# Altium project MB1292.PrjPcb (part 2 of 2)

## Sheet Power_management.SchDoc: Power management
size A4; Date: Not used; ApprovedBy: Not used; CheckedBy: Not used; Author: Not used; CompanyName: STMicroelectronics; DrawnBy: Not used; Engineer: Not used; Organization: Not used; Address1: Not used; Address2: Not used; Address3: Not used; Address4: Not used; DocumentNumber: Not used; Revision: Not used; SheetNumber: 7; SheetTotal: 8; CurrentTime: Not used; CurrentDate: Not used; Time: Not used; DocumentFullPathAndName: Not used; DocumentName: Not used; ModifiedDate: Not used; ImagePath: Not used; ProjectName: Not used; Application_BuildNumber: Not used
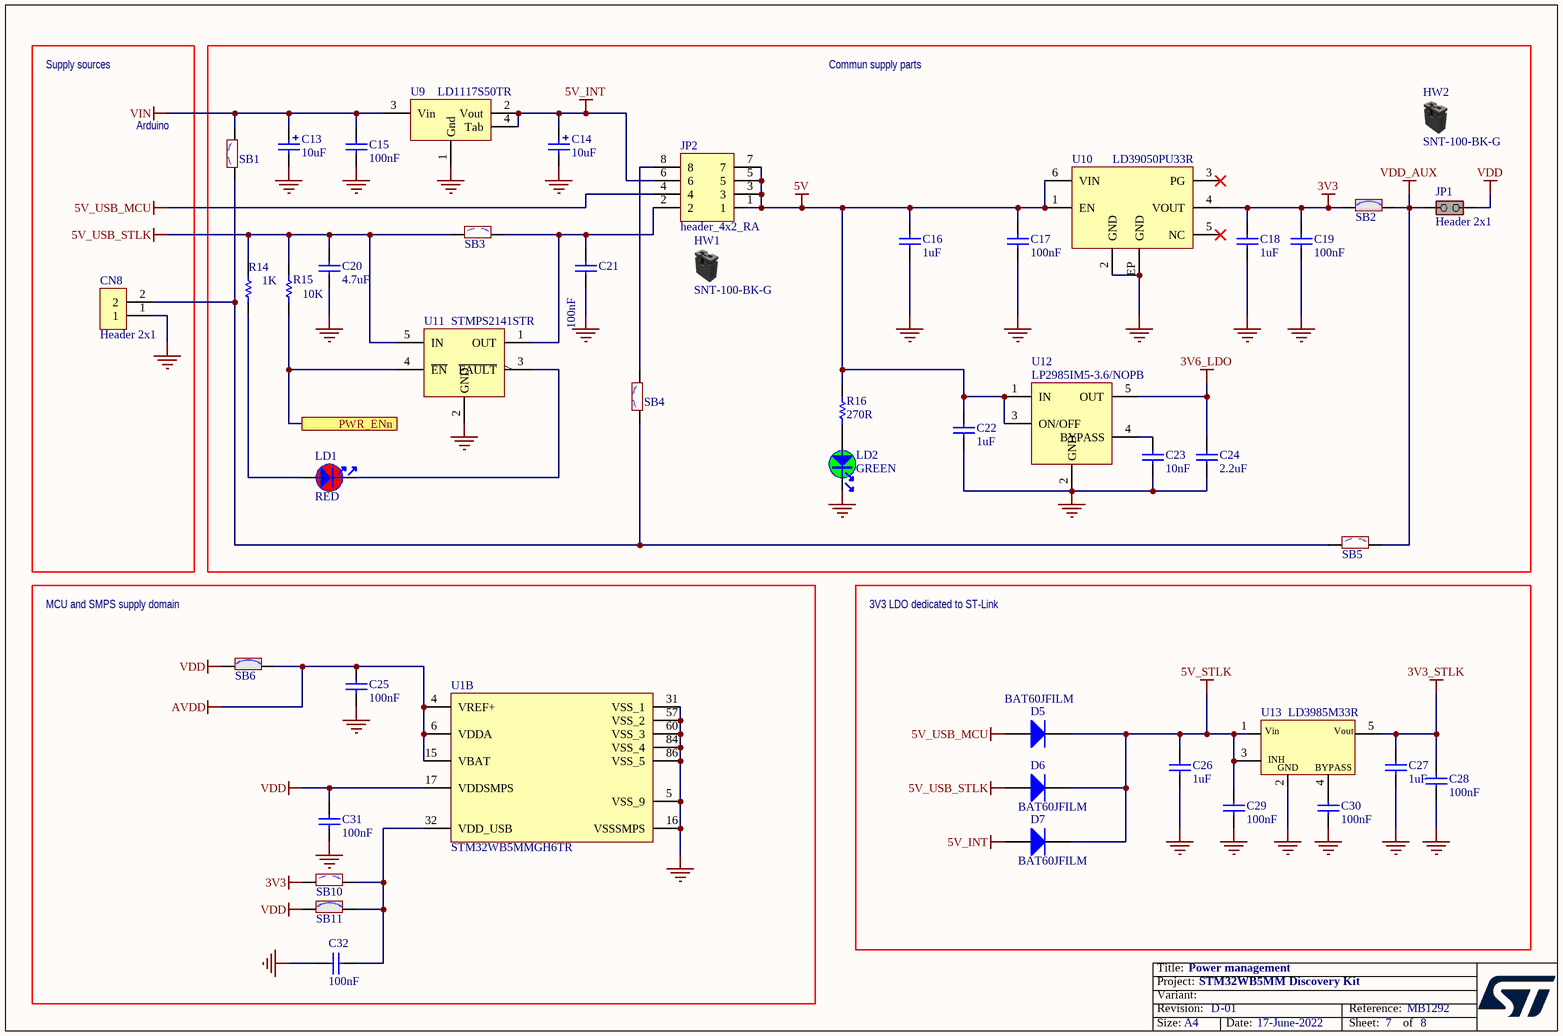
[diagram p4: Power_management.SchDoc]

### Parts
C13  value 10uF  [CPOL_TAJ-B_1210_H210]  (hidden comment: Cap_POL_TANA)
C14  value 10uF  [CPOL_TAJ-B_1210_H210]  (hidden comment: Cap_POL_TANA)
C15  value 100nF  [C0805_H0P85]  (hidden comment: Capacitor)
C16  value 1uF  [C0805_H0P85]  (hidden comment: Capacitor)
C17  value 100nF  [C0201_H0P3]  (hidden comment: Capacitor)
C18  value 1uF  [C0805_H0P85]  (hidden comment: Capacitor)
C19  value 100nF  [C0201_H0P3]  (hidden comment: Capacitor)
C20  value 4.7uF  [C0603_H0P8]  (hidden comment: Capacitor)
C21  value 100nF  [C0805_H0P85]  (hidden comment: Capacitor)
C22  value 1uF  [C0603]  (hidden comment: Capacitor)
C23  value 10nF  [C0603]  (hidden comment: Capacitor)
C24  value 2.2uF  [C0603]  (hidden comment: Capacitor)
C25  value 100nF  [C0201_H0P3]  (hidden comment: Capacitor)
C26  value 1uF  [C0402]  (hidden comment: Capacitor)
C27  value 1uF  [C0402]  (hidden comment: Capacitor)
C28  value 100nF  [C0201_H0P3]  (hidden comment: Capacitor)
C29  value 100nF  [C0201_H0P3]  (hidden comment: Capacitor)
C30  value 100nF  [C0201_H0P3]  (hidden comment: Capacitor)
C31  value 100nF  [C0201_H0P3]  (hidden comment: Capacitor)
C32  value 100nF  [C0201_H0P3]  (hidden comment: Capacitor)
CN8  Header 2x1  [CON_LYCONN_313102S141346]
D5  BAT60JFILM  [DIO_SOD323]
D6  BAT60JFILM  [DIO_SOD323]
D7  BAT60JFILM  [DIO_SOD323]
HW1  value SNT-100-BK-G  (hidden comment: Shunt Black 2.54mm)  (mechanical)
HW2  value SNT-100-BK-G  (hidden comment: Shunt Black 2.54mm)  (mechanical)
JP1  value Header 2x1  [CON_SAMTEC_TSW-102-07-G-S]  (hidden comment: Jumper_Header 2x1 Fitted)
JP2  value header_4x2_RA  [CON_SAMTEC_TSW-104-08-F-D-RA]  (hidden comment: Header 4x2)
LD1  value RED  [LED_0603_VISHAY_VLMS1300-GS08_RED_1A2K_H0P8]  (hidden comment: LED_red)
LD2  value GREEN  [LED_0603_OSRAM_LG-Q396-PS-35_GREEN_1A2K_H0P4]  (hidden comment: LED_green)
R14  value 1K  [R0603]  (hidden comment: Resistor)
R15  value 10K  [R0603]  (hidden comment: Resistor)
R16  value 270R  [R0603]  (hidden comment: Resistor)
SB1  SB_OFF  [SOLDER-BRIDGE_R0603-0R]  (value not drawn)
SB2  SB_ON  [SOLDER-BRIDGE_R0603-0R]  (value not drawn)
SB3  SB_OFF  [SOLDER-BRIDGE_R0603-0R]  (value not drawn)
SB4  SB_OFF  [SOLDER-BRIDGE_R0603-0R]  (value not drawn)
SB5  SB_OFF  [SOLDER-BRIDGE_R0603-0R]  (value not drawn)
SB6  SB_ON  [SOLDER-BRIDGE_R0603-0R]  (value not drawn)
SB10  SB_OFF  [SOLDER-BRIDGE_R0603-0R]  (value not drawn)
SB11  SB_ON  [SOLDER-BRIDGE_R0603-0R]  (value not drawn)
U1  STM32WB5MMGH6TR  [MOD_DORY_STM_86P_7P3X11_H1P342]  (part B of 2)
U9  LD1117S50TR  [REG_SOT223-TAB]
U10  LD39050PU33R  [ICC_DFN6-EPAD_3X3_P095]
U11  STMPS2141STR  [MOS_SOT23-5L]
U12  LP2985IM5-3.6/NOPB  [REG_SOT23-5L]
U13  LD3985M33R  [REG_SOT23-5L]

### Blocks framed on the sheet
Commun supply parts: C13-C24 HW1 HW2 JP1 JP2 LD1 LD2 R14-R16 SB1-SB5 U9-U12
MCU and SMPS supply domain: C25 C31 C32 SB6 SB10 SB11 U1
3V3 LDO dedicated to ST-Link: C26-C30 D5-D7 U13

### Ports
PWR_ENn

### Nets
3V3: C18.2 C19.2 SB2.1 SB10.1 U10.4(VOUT)
3V3_STLK: C27.2 C28.2 U13.5(Vout)
3V6_LDO: C24.2 U12.5(OUT)
5V: C16.2 C17.2 C22.1 JP2.1 JP2.3 JP2.5 JP2.7 R16.2 U10.1(EN) U10.6(VIN) U12.1(IN) U12.3(ON/OFF)
5V_INT: C14.1 D7.1(A) JP2.6 U9.2(Vout) U9.4(Tab)
5V_STLK: C26.2 C29.2 D5.2(K) D6.2(K) D7.2(K) U13.1(Vin) U13.3(CE)
5V_USB_MCU: D5.1(A) JP2.4
5V_USB_STLK: C20.2 D6.1(A) R14.2 R15.2 SB3.1 U11.5(IN)
AVDD: C25.2 SB6.2 U1.4(VREF+) U1.6(VDDA) U1.15(VBAT)
GND: C13.2 C14.2 C15.1 C16.1 C17.1 C18.1 C19.1 C20.1 C21.1 C22.2 C23.1 C24.1 C25.1 C26.1 C27.1 C28.1 C29.1 C30.1 C31.1 C32.2 CN8.1 LD2.2 U1.5(VSS_9) U1.16(VSSSMPS) U1.31(VSS_1) U1.57(VSS_2) U1.60(VSS_3) U1.84(VSS_4) U1.86(VSS_5) U9.1(Gnd) U10.2(GND) U10.EP(GND) U11.2(GND) U12.2(GND) U13.2(GND)
VDD: C31.2 JP1.2(NO) SB6.1 SB11.1 U1.17(VDDSMPS)
VDD_AUX: JP1.1(COMMON) SB2.2 SB5.2
VIN: C13.1 C15.2 SB1.2 U9.3(Vin)
PWR_ENn: R15.1 U11.4(~{EN}) ; port PWR_ENn
NetC21_2: C21.2 JP2.2 SB3.2 U11.1(OUT)
NetC23_2: C23.2 U12.4(BYPASS)
NetC30_2: C30.2 U13.4(BYPASS)
NetC32_1: C32.1 SB10.2 SB11.2 U1.32(VDD_USB)
NetCN8_2: CN8.2 SB1.1 SB4.1 SB5.1
NetJP2_8: JP2.8 SB4.2
NetLD1_1: LD1.1 R14.1
NetLD1_2: LD1.2 U11.3(~{FAULT})
NetLD2_1: LD2.1 R16.1

Not connected (* = marked no-connect by the designer): U10 3(PG)* 5(NC)*

### Notes on the sheet
- Supply sources
- Arduino
- Title:
- Project:
- Size:
- Revision:
- Variant:
- A4
- -
- Date:
- Reference:
- Sheet:
- of
- (in symbol MCD-00086) INH

### Library data of the parts
C13 C14 = MCD-00324: Capacitor, Tantalum, 10uF, 25V,2.5ohms, 10%, pkg Type_B (3528 metric), T=1.9mm; Manufacturer_Part_Number: TAJB106K025RNJ; Manufacturer: AVX; Part_Preference: Recommended; Order_Code_RS: 136-0159; Revision: July-2002: Re-released for DXP Platform.; Internal_Part_Number: MCD-00324; Status: Released; Part_Type: Capacitor; Package: Type_B; ComponentLink1URL: http://tunmcdsvn.tun.st.com/Component_Datasheet_Library/Trunk/Capacitors/AVX_Capacitor_TAJ-series; Order_Code_Digikey: 478-5257-1-ND; Order_Code_Farnell: 2333024
C15 C21 = MCD-01525: Capacitor, MLCC, 100nF, 50V, X7R, 10%, 0805, T=0,85mm; Manufacturer_Part_Number: CC0805KRX7R9BB104; Manufacturer: YAGEO; BMS_Part_Number: 9142249; Part_Preference: Recommended; Order_Code_RS: 669-8842; Internal_Part_Number: MCD-01525; Status: Released; Part_Type: Capacitor; Package: C0805; ComponentLink1URL: http://tunmcdsvn.tun.st.com/Component_Datasheet_Library/Trunk/Capacitors/Yageo_Multilayer_Capacitor_X7R_series_100pF_to_22uF/Yageo_Mutilayer_Capacitor_X7R_100pF_to_22uF.pdf; Order_Code_Digikey: 311-1140-1-ND; Order_Code_Farnell: 3019949
C16 C18 = MCD-01550: Capacitor, MLCC, 1uF, 16V, X5R, +/-10%, 0805, T=0.85mm; Manufacturer_Part_Number: CC0805KRX5R7BB105; Manufacturer: YAGEO; Part_Preference: Recommended; Internal_Part_Number: MCD-01550; Status: Released; Part_Type: Capacitor; Alternate_Manufacturer_Part_Number: N/A; Alternate_Manufacturer: N/A; Package: C0805; ComponentLink1URL: http://tunmcdsvn.tun.st.com/Component_Datasheet_Library/Trunk/Capacitors/Yageo_Multilayer_Capacitor_X7R_series_100pF_to_22uF/YAGEO_MLCC_UPY-GPHC_X7R_6.3V-to-50V_18.pdf; Order_Code_Digikey: 311-3427-1-ND; Order_Code_Farnell: N/A; Order_Code_RS: N/A
C17 C19 C25 C28-C32 = MCD-01535: Capacitor, MLCC,100nF, 10V, X7R, +/-10%, 0201, T=0.3mm; Manufacturer_Part_Number: GRM033R61A104KE15; Manufacturer: MURATA; Part_Preference: Recommended; Order_Code_RS: 790-2742; Internal_Part_Number: MCD-01535; Status: Checked; Part_Type: Capacitor; Package: C0201; ComponentLink1URL: http://tunmcdsvn.tun.st.com/Component_Datasheet_Library/Trunk/Capacitors/Murata_Capacitor_GR_series; Alternate_Manufacturer: N/A; Alternate_Manufacturer_Part_Number: N/A; Order_Code_Digikey: 490-5881-1-ND; Order_Code_Farnell: 2470450
C20 = MCD-01721: Capacitor, MLCC, 4.7uF, 10V, X5R, +/-10%, 0603, T=0.8mm; Manufacturer_Part_Number: CC0603KRX5R6BB475; Manufacturer: YAGEO; Part_Preference: Recommended; Internal_Part_Number: MCD-01721; Status: Released; Part_Type: Capacitor; Package: C0603; ComponentLink1URL: http://tunmcdsvn.tun.st.com/Component_Datasheet_Library/Trunk/Capacitors/Yageo_Multilayer_capacitor_X5R_series_100pF_to_100uF/YAGEO_MLCC_UPY-GPHC_X5R_4V-to-50V_25.pdf; Order_Code_Digikey: 311-1455-1-ND; Order_Code_Farnell: 1458898; Order_Code_RS: N/A
C22 = MCD-00010: Capacitor, MLCC, 1uF, 16V, X5R, +/-10%, 0603, T=0,8mm; Manufacturer_Part_Number: CC0603KRX5R7BB105; Manufacturer: YAGEO; Part_Preference: Recommended; Internal_Part_Number: MCD-00010; Status: Released; Part_Type: Capacitor; Package: C0603; ComponentLink1URL: http://tunmcdsvn.tun.st.com/Component_Datasheet_Library/Trunk/Capacitors/Yageo_Multilayer_capacitor_X5R_series_100pF_to_100uF; Order_Code_Digikey: 311-1444-1-ND; Order_Code_Farnell: 2370680; Order_Code_RS: N/A
C23 = MCD-01007: Capacitor, MLCC, 10nF, 16V, X7R, +/-10%, 0603, T=0.8mm; Manufacturer_Part_Number: CC0603KRX7R7BB103; Manufacturer: YAGEO; Part_Preference: Recommended; Internal_Part_Number: MCD-01007; Status: Released; Part_Type: Capacitor; Package: C0603; ComponentLink1URL: http://tunmcdsvn.tun.st.com/Component_Datasheet_Library/Trunk/Capacitors/Yageo_Multilayer_Capacitor_X7R_series_100pF_to_22uF/; Order_Code_Digikey: 311-3369-1-ND; Order_Code_Farnell: N/A; Order_Code_RS: N/A
C24 = MCD-00012: Capacitor, MLCC, 2.2uF, 10V, X5R, +/- 10%, 0603, T=0,8mm; Manufacturer_Part_Number: CC0603KRX5R6BB225; Manufacturer: YAGEO; Alternate_Manufacturer_Part_Number: C0603C225K8PACTU; Alternate_Manufacturer: KEMET; BMS_Part_Number: 9142010; Part_Preference: Recommended; Internal_Part_Number: MCD-00012; Status: Released; Part_Type: Capacitor; Package: C0603; ComponentLink1URL: http://tunmcdsvn.tun.st.com/Component_Datasheet_Library/Trunk/Capacitors/Yageo_Multilayer_capacitor_X5R_series_100pF_to_100uF; Order_Code_Digikey: 311-1451-1-ND; Order_Code_Farnell: 2370679; Order_Code_RS: N/A
C26 C27 = MCD-01722: Capacitor, MLCC, 1uF, 10V, X5R, +/-10%, 0402, T=0.5mm; Manufacturer_Part_Number: CC0402KRX5R6BB105; Manufacturer: YAGEO; Part_Preference: Recommended; Internal_Part_Number: MCD-01722; Status: Released; Part_Type: Capacitor; Package: C0402; ComponentLink1URL: http://tunmcdsvn.tun.st.com/Component_Datasheet_Library/Trunk/Capacitors/Yageo_Multilayer_capacitor_X5R_series_100pF_to_100uF/Yageo_Multilayer_capacitor_X5R_100pF_to_100uF.pdf; Order_Code_Digikey: 311-1439-1-ND; Order_Code_Farnell: 1458896; Order_Code_RS: N/A
CN8 = MCD-01668: Header 2x1, 2.54mm, VR, TH, height 5.84mm/5.08 mm, height total 13.46 mm; Part_Type: Connector; Manufacturer_Part_Number: 313102S141346; Manufacturer: LYCONN; Part_Preference: Recommended; Internal_Part_Number: MCD-01668; Value: Header 2x1; Status: Released; ComponentLink1URL: http://tunmcdsvn.tun.st.com/Component_Datasheet_Library/Trunk/Connectors/LYCONN_31XXX_2.54mm_L13.46mm/LYCONN_31XXX_2.54mm_L13.46mm.pdf
D5-D7 = MCD-00034: Manufacturer: STMICROELECTRONICS; Part_Type: Diode; BMS_Part_Number: 9151097; Part_Preference: Recommended; Manufacturer_HQ_COO: EU; Internal_Part_Number: MCD-00034; Value: BAT60JFILM; Manufacturer_Part_Number: BAT60JFILM; Status: Released; ComponentLink1URL: http://tunmcdsvn.tun.st.com/Component_Datasheet_Library/Trunk/Diodes/STM_Diode_BAT60JFILM-SOD323
HW1 HW2 = MCD-00043: SHUNT 2.54mm BLACK; Part_Type: Misc; Manufacturer: SAMTEC; Alternate_Manufacturer_Part_Number: 316102S111A; Alternate_Manufacturer: JIUBABA; Part_Preference: Recommended; Internal_Part_Number: MCD-00043; Status: Released; Manufacturer_Part_Number: SNT-100-BK-G; ComponentLink1URL: http://tunmcdsvn.tun.st.com/Component_Datasheet_Library/Trunk/Connectors/Samtec_Shunt_Jumper_SNT100
JP1 = MCD-01904: Header, 2x1, 2,54mm, VR, TH, Height 5.84mm/2.54mm - Shunt Fitted by default; Part_Type: Connector; Manufacturer_Part_Number: TSW-102-07-G-S; Manufacturer: SAMTEC; Part_Preference: Recommended; Order_Code_RS: 155-7981; Internal_Part_Number: MCD-01904; Status: Checked; ComponentLink1URL: http://tunmcdsvn.tun.st.com/Component_Datasheet_Library/Trunk/Connectors/Samtec_TSW-HTSW-series; Alternate_Manufacturer: N/A; Alternate_Manufacturer_Part_Number: N/A; Order_Code_Digikey: SAM1029-02-ND; Order_Code_Farnell: 2505044
JP2 = MCD-02037: Header, 4x2, 2,29mm, RA, TH, height 5,84mm; Part_Type: Connector; Manufacturer_Part_Number: TSW-104-08-F-D-RA; Manufacturer: SAMTEC; Part_Preference: Recommended; Internal_Part_Number: MCD-02037; Status: Released; ComponentLink1URL: http://tunmcdsvn.tun.st.com/Component_Datasheet_Library/Trunk/Connectors/Samtec_TSW-HTSW-series/; Order_Code_Digikey: SAM13034-ND; Order_Code_Farnell: 2032652; Order_Code_RS: N/A; Alternate_Manufacturer_Part_Number: N/A; Alternate_Manufacturer: N/A
LD1 = MCD-00587: LED Red, 0603 SMD, 2V Forward Voltage; Part_Type: Display; Part_Preference: Recommended; Manufacturer: VISHAY; Manufacturer_Part_Number: VLMS1300-GS08; Full_Alternate_Internal_Part_Number: MCD-02401; Component_Country_Of_Origin: China; ShowFields: YES; ID: 3154; Internal_Part_Number: MCD-00587; Status: Released; Package: LED 0603; ComponentLink1URL: http://tunmcdsvn.tun.st.com/Component_Documentation_Library/Trunk/Display/VISHAY_VLMx1300-GS08_Series; Order_Code_Digikey: VLMS1300-GS08CT-ND; Order_Code_Farnell: 2078728; Order_Code_RS: N/A
LD2 = MCD-00588: LED Green, 0603 SMD, Forward Voltage Typ=2V, Max=2.5V; Part_Type: Display; Manufacturer_Part_Number: LG Q396-PS-35; Manufacturer: OSRAM OPTO SEMICONDUCTORS; Alternate_Manufacturer_Part_Number: VLMTG1300-GS08; Alternate_Manufacturer: VISHAY SEMICONDUCTOR OPTO DIVISION; Part_Preference: Recommended; Internal_Part_Number: MCD-00588; Status: Released; Package: LED 0603; ComponentLink1URL: http://tunmcdsvn.tun.st.com/Component_Datasheet_Library/Trunk/Display/OSRAM_LED_GREEN_LG Q396-PS-35; Order_Code_Digikey: LG Q396-PS-35-ND
R14 = MCD-00070: Resistor,1K,0603,1%,1/10W; Manufacturer_Part_Number: RC0603FR-071KL; Manufacturer: YAGEO; Part_Preference: Recommended; Internal_Part_Number: MCD-00070; Status: Released; Part_Type: Resistor; Package: R0603; ComponentLink1URL: http://tunmcdsvn.tun.st.com/Component_Datasheet_Library/Trunk/Resistors/Yageo_Resistor_RC0603-series; Order_Code_Digikey: 311-1.00KHRCT-ND; Order_Code_Farnell: 9238484RL; Order_Code_RS: N/A
R15 = MCD-00220: Resistor,10K,0603,1%,1/10W; Manufacturer_Part_Number: RC0603FR-0710KL; Manufacturer: YAGEO; Part_Preference: Recommended; Internal_Part_Number: MCD-00220; Status: Released; Part_Type: Resistor; Package: R0603; ComponentLink1URL: http://tunmcdsvn.tun.st.com/Component_Datasheet_Library/Trunk/Resistors/Yageo_Resistor_RC0603-series; Order_Code_Digikey: 311-10.0KHRCT-ND; Order_Code_Farnell: 9238603; Order_Code_RS: N/A
R16 = MCD-00442: Resistor,270R,0603,1%,1/10W; Manufacturer_Part_Number: RC0603FR-07270RL; Manufacturer: YAGEO; Part_Preference: Recommended; Internal_Part_Number: MCD-00442; Status: Released; Part_Type: Resistor; Package: R0603; ComponentLink1URL: http://tunmcdsvn.tun.st.com/Component_Datasheet_Library/Trunk/Resistors/Yageo_Resistor_RC0603-series; Order_Code_Digikey: 311-270HRCT-ND; Order_Code_Farnell: 9238417; Order_Code_RS: N/A
SB1 SB3-SB5 SB10 = MCD-00072: Solder Bridge OFF; Part_Type: Misc; Manufacturer_Part_Number: RC0603JR-070RL; Manufacturer: YAGEO; Part_Preference: Recommended; Internal_Part_Number: MCD-00072; Status: Released; Package: SB0603; ComponentLink1URL: http://tunmcdsvn.tun.st.com/Component_Datasheet_Library/Trunk/Resistors/Yageo_Resistor_RC0603-series
SB2 SB6 SB11 = MCD-00071: Solder Bridge ON; Part_Type: Misc; Manufacturer_Part_Number: RC0603JR-070RL; Manufacturer: YAGEO; Part_Preference: Recommended; Internal_Part_Number: MCD-00071; Status: Released; Package: SB0603; ComponentLink1URL: http://tunmcdsvn.tun.st.com/Component_Datasheet_Library/Trunk/Resistors/Yageo_Resistor_RC0603-series
U1 = MCD-01965: STM32 BLE module based on STM32WB55; Part_Type: Misc; Manufacturer: STMICROELECTRONICS; Part_Preference: Recommended; Manufacturer_HQ_COO: EU; Component_Country_Of_Origin: Taiwan; Value: STM32WB5MMGH6TR; Order_Code_Digikey: N/A; Order_Code_Farnell: N/A; Order_Code_RS: N/A; Status: Checked; ComponentLink1URL: http://tunmcdsvn.tun.st.com/Component_Datasheet_Library/Trunk/Misc/STM_STM32WBxxx_dory_module; Internal_Part_Number: MCD-01965; Manufacturer_Part_Number: STM32WB5MMGH6TR; Alternate_Manufacturer_Part_Number: N/A; Alternate_Manufacturer: N/A
U9 = MCD-00088: IC REG LDO 5V 0.8A SOT223; Manufacturer: STMICROELECTRONICS; BMS_Part_Number: 9176133; Part_Preference: Recommended; Manufacturer_HQ_COO: EU; Internal_Part_Number: MCD-00088; Value: LD1117S50TR; Status: Released; Part_Type: IC; Manufacturer_Part_Number: LD1117S50TR; Package: SOT-223; ComponentLink1URL: http://tunmcdsvn.tun.st.com/Component_Datasheet_Library/Trunk/IC/STM_LDO_LD1117
U10 = MCD-00215: Low quiescent current and low noise voltage regulators; Part_Type: IC; Manufacturer: STMICROELECTRONICS; BMS_Part_Number: 9176126; Part_Preference: Recommended; Manufacturer_HQ_COO: EU; Internal_Part_Number: MCD-00215; Value: LD39050PU33R; Status: Released; Manufacturer_Part_Number: LD39050PU33R; Package: DFN6 3x3mm; ComponentLink1URL: http://tunmcdsvn.tun.st.com/Component_Datasheet_Library/Trunk/IC/STM_LDO_LD39050PU
U11 = MCD-00083: Enhanced single channel power switches with active low enable pin; Part_Type: IC; Manufacturer: STMICROELECTRONICS; Alternate_Manufacturer_Part_Number: TPS2041C; Alternate_Manufacturer: TEXAS INSTRUMENTS; BMS_Part_Number: 9159003; Part_Preference: Recommended; Manufacturer_HQ_COO: EU; Internal_Part_Number: MCD-00083; Value: STMPS2141STR; Status: Released; Manufacturer_Part_Number: STMPS2141STR; ComponentLink1URL: http://tunmcdsvn.tun.st.com/Component_Datasheet_Library/Trunk/IC/STM_PWR-Switch_STMPS2141STR
U12 = MCD-01030: LDO VOLTAGE REGULATOR, 3.6V, 150mA, 5-SOT-23, FULL REEL; Part_Type: IC; Manufacturer: TEXAS INSTRUMENTS; Part_Preference: Recommended; Order_Code_RS: 651-9948; Internal_Part_Number: MCD-01030; Value: LP2985IM5-3.6/NOPB; Status: Checked; Manufacturer_Part_Number: LP2985IM5-3.6/NOPB; Package: REG_SOT23-5L; ComponentLink1URL: http://tunmcdsvn.tun.st.com/Component_Datasheet_Library/Trunk/IC/TI_LDO_LP2985IM5-3.6; Alternate_Manufacturer: N/A; Alternate_Manufacturer_Part_Number: N/A; Order_Code_Digikey: LP2985IM5-3.6/NOPBCT-ND; Order_Code_Farnell: 3007634
U13 = MCD-00086: Ultra low drop-low noise BiCMOS voltage, regulators low ESR capacitors compatible; Part_Type: IC; Manufacturer: STMICROELECTRONICS; BMS_Part_Number: 9176161; Part_Preference: Recommended; Manufacturer_HQ_COO: EU; Internal_Part_Number: MCD-00086; Value: LD3985M33R; Status: Released; Manufacturer_Part_Number: LD3985M33R; ComponentLink1URL: http://tunmcdsvn.tun.st.com/Component_Datasheet_Library/Trunk/IC/STM_LDO_LD3985

## Sheet ST-LINK_V2-1.SchDoc: ST-LINK V2-1
size A4; Date: Not used; ApprovedBy: Not used; CheckedBy: Not used; Author: Not used; CompanyName: STMicroelectronics; DrawnBy: Not used; Engineer: Not used; Organization: Not used; Address1: Not used; Address2: Not used; Address3: Not used; Address4: Not used; DocumentNumber: Not used; Revision: Not used; SheetNumber: 8; SheetTotal: 8; CurrentTime: Not used; CurrentDate: Not used; Time: Not used; DocumentFullPathAndName: Not used; DocumentName: Not used; ModifiedDate: Not used; ImagePath: Not used; ProjectName: Not used; Application_BuildNumber: Not used
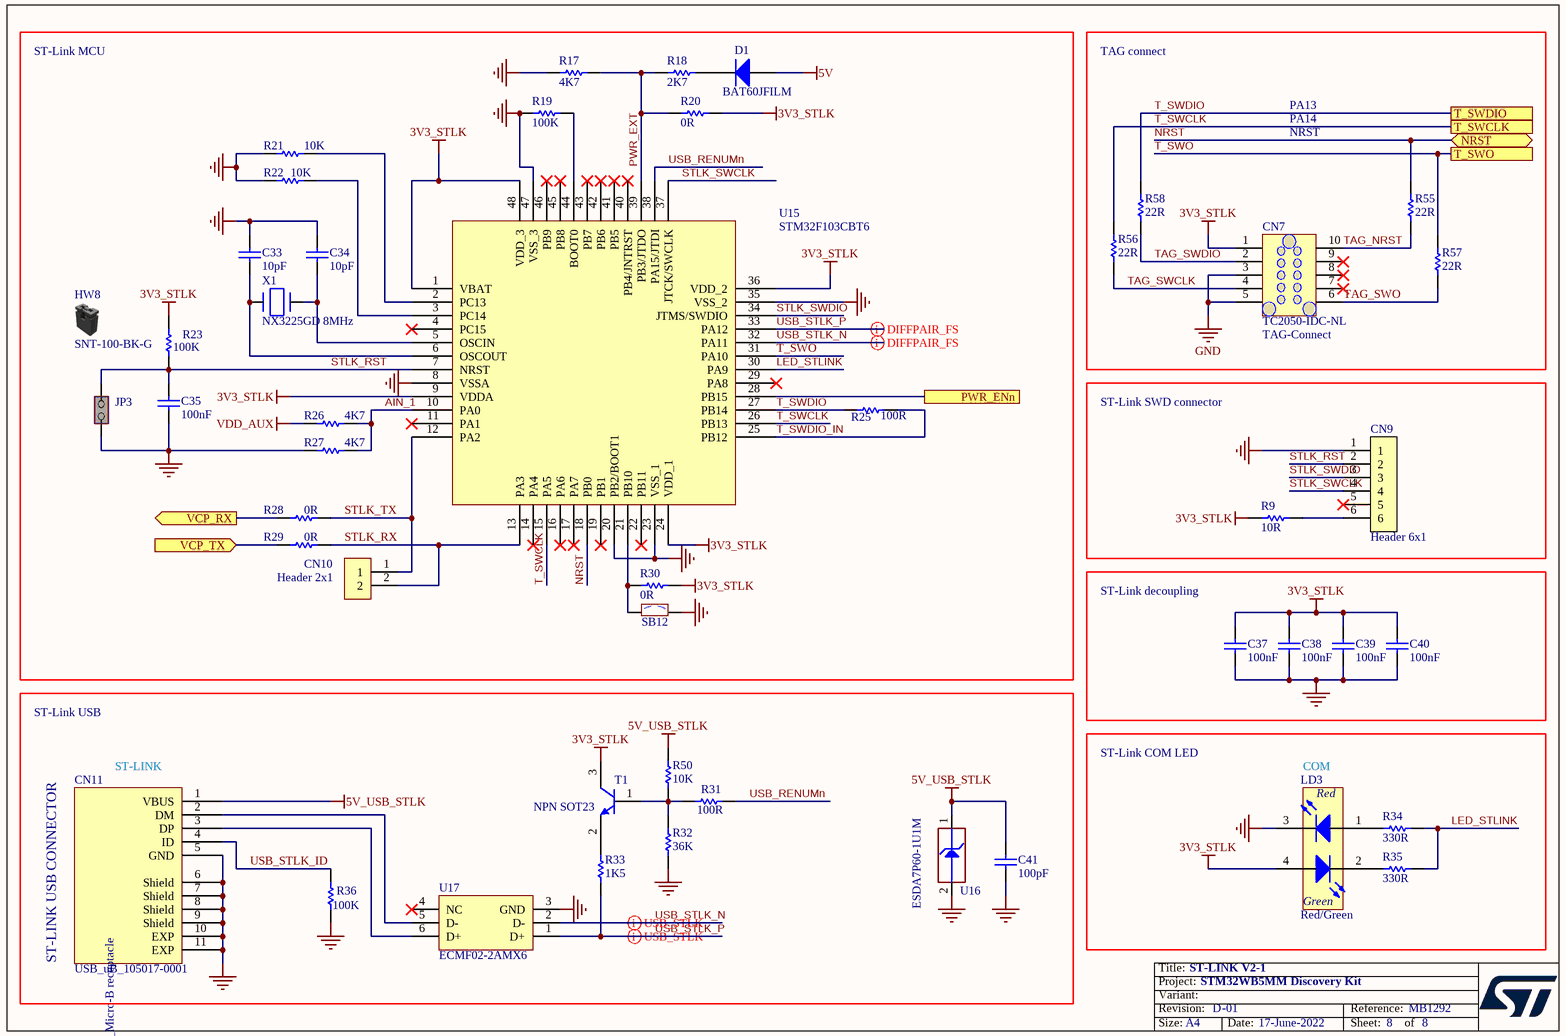
[diagram p5: ST-LINK_V2-1.SchDoc]

### Parts
C33  value 10pF  [C0402]  (hidden comment: Capacitor)
C34  value 10pF  [C0402]  (hidden comment: Capacitor)
C35  value 100nF  [C0402]  (hidden comment: Capacitor)
C37  value 100nF  [C0402]  (hidden comment: Capacitor)
C38  value 100nF  [C0402]  (hidden comment: Capacitor)
C39  value 100nF  [C0402]  (hidden comment: Capacitor)
C40  value 100nF  [C0402]  (hidden comment: Capacitor)
C41  value 100pF  [C0603_H0P8]  (hidden comment: Capacitor)
CN7  value TC2050-IDC-NL  [CON_TAG-C_TC2050-IDC-NL]  (hidden comment: Tag-10-C)
CN9  Header 6x1  [CON_SAMTEC_TSW-106-14-G-S]
CN10  Header 2x1  [CON_SAMTEC_TSW-102-07-G-S]
CN11  value USB_uB_105017-0001  [CON_USBMICROB_MOLEX_105017-0001_H2P90]  (hidden comment: USB_uB_105017.0001)
D1  BAT60JFILM  [DIO_SOD323]
HW8  value SNT-100-BK-G  (hidden comment: Shunt Black 2.54mm)  (mechanical)
JP3  Jumper_Header 2x1 Fitted  [CON_SAMTEC_TSW-102-07-G-S]  (value not drawn)
LD3  value Red/Green  [LED_BI-GR_WE-150141SV73110]  (hidden comment: LED_BICOLOR)
R9  value 10R  [R0402]  (hidden comment: Resistor)
R17  value 4K7  [R0402]  (hidden comment: Resistor)
R18  value 2K7  [R0402]  (hidden comment: Resistor)
R19  value 100K  [R0402]  (hidden comment: Resistor)
R20  value 0R  [R0402]  (hidden comment: Resistor)
R21  value 10K  [R0402]  (hidden comment: Resistor)
R22  value 10K  [R0402]  (hidden comment: Resistor)
R23  value 100K  [R0402]  (hidden comment: Resistor)
R25  value 100R  [R0402]  (hidden comment: Resistor)
R26  value 4K7  [R0402]  (hidden comment: Resistor)
R27  value 4K7  [R0402]  (hidden comment: Resistor)
R28  value 0R  [R0402]  (hidden comment: Resistor)
R29  value 0R  [R0402]  (hidden comment: Resistor)
R30  value 0R  [R0402]  (hidden comment: Resistor)
R31  value 100R  [R0402]  (hidden comment: Resistor)
R32  value 36K  [R0402]  (hidden comment: Resistor)
R33  value 1K5  [R0402]  (hidden comment: Resistor)
R34  value 330R  [R0402]  (hidden comment: Resistor)
R35  value 330R  [R0402]  (hidden comment: Resistor)
R36  value 100K  [R0402]  (hidden comment: Resistor)
R50  value 10K  [R0402]  (hidden comment: Resistor)
R55  value 22R  [R0402]  (hidden comment: Resistor)
R56  value 22R  [R0402]  (hidden comment: Resistor)
R57  value 22R  [R0402]  (hidden comment: Resistor)
R58  value 22R  [R0402]  (hidden comment: Resistor)
SB12  SB_OFF  [SOLDER-BRIDGE_R0603-0R]  (value not drawn)
T1  value NPN SOT23  [NPN_SOT23]  (hidden comment: 9013-SOT23)
U15  STM32F103CBT6  [ICC_LQFP48_7X7_P050]
U16  value ESDA7P60-1U1M  [ESD_QFN2_1P6X1_P125]  (hidden comment: ESD-TRANSIL)
U17  ECMF02-2AMX6  [ESD_QFN-6L_1P7X1P5_P050]
X1  value NX3225GD 8MHz  [CRY_NX3225GD_2P]  (hidden comment: XTAL_2_PINS)

### Blocks framed on the sheet
ST-Link MCU: C33-C35 CN10 D1 HW8 JP3 R17-R23 R25-R30 SB12 U15 X1
ST-Link SWD connector: CN9 R9
ST-Link decoupling: C37-C40
ST-LINK USB CONNECTOR: C41 CN11 R31-R33 R36 R50 T1 U16 U17

### Ports
NRST (bidir), PWR_ENn, T_SWCLK, T_SWDIO, T_SWO, VCP_RX (out), VCP_TX (in)

### Nets
3V3_STLK: C37.2 C38.2 C39.2 C40.2 CN7.1 LD3.4(Green_anode) R9.1 R20.2 R23.2 R30.2 T1.3(C) U15.1(VBAT) U15.9(VDDA) U15.24(VDD_1) U15.36(VDD_2) U15.48(VDD_3)
5V: D1.1(A)
5V_USB_STLK: C41.1 CN11.1(VBUS) R50.2 U16.1(IO1)
GND: C33.2 C34.2 C35.1 C37.1 C38.1 C39.1 C40.1 C41.2 CN7.3 CN7.5 CN9.1 CN11.5(GND) CN11.6(Shield) CN11.7(Shield) CN11.8(Shield) CN11.9(Shield) CN11.10(EXP) CN11.11(EXP) JP3.2(NO) LD3.3(RED_cathode) R17.1 R19.1 R21.2 R22.1 R27.1 R32.1 R36.1 SB12.2 U15.8(VSSA) U15.20(PB2/BOOT1) U15.23(VSS_1) U15.35(VSS_2) U15.47(VSS_3) U16.2(GND) U17.3(GND)
VDD_AUX: R26.1
AIN_1: R26.2 R27.2 U15.10(PA0)
LED_STLINK: R34.2 R35.2 U15.30(PA9)
NRST: R55.2 U15.18(PB0) ; port NRST
PWR_ENn: U15.28(PB15) ; port PWR_ENn
PWR_EXT: R17.2 R18.1 R20.1 U15.39(PB3/JTDO)
STLK_RST: C35.2 CN9.2 JP3.1(COMMON) R23.1 U15.7(NRST)
STLK_RX: CN10.2 R29.2 U15.13(PA3)
STLK_SWCLK: CN9.4 U15.37(JTCK/SWCLK)
STLK_SWDIO: CN9.3 U15.34(JTMS/SWDIO)
STLK_TX: CN10.1 R28.1 U15.12(PA2)
T_SWCLK: R56.2 U15.15(PA5) U15.26(PB13) ; port T_SWCLK
T_SWDIO: R25.1 R58.2 U15.27(PB14) ; port T_SWDIO
T_SWDIO_IN: R25.2 U15.25(PB12)
T_SWO: R57.1 U15.31(PA10) ; port T_SWO
TAG_NRST: CN7.10 R55.1
TAG_SWCLK: CN7.4 R56.1
TAG_SWDIO: CN7.2 R58.1
TAG_SWO: CN7.6 R57.2
USB_RENUMn: R31.2 U15.38(PA15/JTDI)
USB_STLK_ID: CN11.4(ID) R36.2
USB_STLK_N: U15.32(PA11) U17.2(D-)
USB_STLK_P: R33.1 U15.33(PA12) U17.1(D+)
VCP_RX: R28.2 ; port VCP_RX
VCP_TX: R29.1 ; port VCP_TX
NetC33_1: C33.1 U15.6(OSCOUT) X1.2(X2)
NetC34_1: C34.1 U15.5(OSCIN) X1.1(X1)
NetCN9_6: CN9.6 R9.2
NetCN11_2: CN11.2(DM) U17.5(D-)
NetCN11_3: CN11.3(DP) U17.6(D+)
NetD1_2: D1.2(K) R18.2
NetLD3_1: LD3.1(Red_anode) R34.1
NetLD3_2: LD3.2(Green_cathode) R35.1
NetR19_2: R19.2 U15.44(BOOT0)
NetR21_1: R21.1 U15.2(PC13)
NetR22_2: R22.2 U15.3(PC14)
NetR30_1: R30.1 SB12.1 U15.21(PB10)
NetR31_1: R31.1 R32.2 R50.1 T1.1(B)
NetR33_2: R33.2 T1.2(E)

Not connected (* = marked no-connect by the designer): CN7 7* 8* 9*; CN9 5*; U15 4(PC15)* 11(PA1)* 14(PA4)* 16(PA6)* 17(PA7)* 19(PB1)* 22(PB11)* 29(PA8)* 40(PB4/JNTRST)* 41(PB5)* 42(PB6)* 43(PB7)* 45(PB8)* 46(PB9)*; U17 4(NC)*

### Layout directives
differential pair: USB_STLK_N, USB_STLK_P

### Notes on the sheet
- TAG connect
- PA13
- PA14
- NRST
- (near CN7) TAG-Connect
- ST-Link USB
- (near CN11) ST-LINK
- ST-Link COM LED
- COM
- Title:
- Project:
- Size:
- Revision:
- Variant:
- A4
- -
- Date:
- Reference:
- Sheet:
- of
- (in symbol MCD-00028) USB_Micro-B receptacle
- (in symbol MCD-02631) Red; Green

### Library data of the parts
C33 C34 = MCD-00015: Capacitor, MLCC, 10pF, 50V, NPO, +/-5%, 0402, T=0,5mm; Manufacturer_Part_Number: CC0402JRNPO9BN100; Manufacturer: YAGEO; Part_Preference: Recommended; Internal_Part_Number: MCD-00015; Status: Released; Part_Type: Capacitor; Package: C0402; ComponentLink1URL: http://tunmcdsvn.tun.st.com/Component_Datasheet_Library/Trunk/Capacitors/Yageo_Capacitor_NP0_16V-to-50V
C35 C37-C40 = MCD-00006: Capacitor, MLCC, 100nF, 16V, X7R, +/-10%, 0402, T=0.5mm; Manufacturer_Part_Number: CC0402KRX7R7BB104; Manufacturer: YAGEO; Alternate_Manufacturer_Part_Number: GCM155R71C104KA55D; Alternate_Manufacturer: MURATA; Part_Preference: Recommended; Order_Code_RS: 616-9701; Internal_Part_Number: MCD-00006; Status: Released; Part_Type: Capacitor; Package: C0402; ComponentLink1URL: http://tunmcdsvn.tun.st.com/Component_Datasheet_Library/Trunk/Capacitors/Yageo_Multilayer_Capacitor_X7R_series_100pF_to_22uF; Order_Code_Digikey: 311-1338-1-ND; Order_Code_Farnell: 9402047
C41 = MCD-01648: Capacitor,MLCC,100pF 50V,NPO,+/-5%, 0603,T=0,8mm; Manufacturer_Part_Number: CC0603JRNPO9BN101; Manufacturer: YAGEO; Part_Preference: Recommended; Order_Code_RS: 625-0267; Internal_Part_Number: MCD-01648; Status: Released; Part_Type: Capacitor; Package: C0603; ComponentLink1URL: http://tunmcdsvn.tun.st.com/Component_Datasheet_Library/Trunk/Capacitors/Yageo_UPY-GP_NP0_16V-to-50V/YAGEO_NP0_UPY-GP_NP0_16V-to-50V_16.pdf; Order_Code_Digikey: 311-1069-1-ND; Order_Code_Farnell: 722080
CN7 = MCD-00031: Tag_Connector Header, 10x2, No legs; Manufacturer_Part_Number: TC2050-IDC-NL-FP; Manufacturer: TAG-CONNECT LLC; Part_Preference: Recommended; Internal_Part_Number: MCD-00031; Status: Released; Part_Type: Connector; ComponentLink1URL: http://tunmcdsvn.tun.st.com/Component_Datasheet_Library/Trunk/Connectors/TAG_Connector_TC2050-IDC-NLFP
CN9 = MCD-01592: Header 6x1, 2,54mm, height 10.67mm; Part_Type: Connector; Manufacturer_Part_Number: TSW-106-14-G-S; Manufacturer: SAMTEC; Part_Preference: Recommended; Order_Code_RS: 180-1121; Internal_Part_Number: MCD-01592; Value: Header 6x1; Status: Checked; ComponentLink1URL: http://tunmcdsvn.tun.st.com/Component_Datasheet_Library/Trunk/Connectors/Samtec_TSW-HTSW-series/Samtec_TSW-HTSW-series.pdf; Alternate_Manufacturer: N/A; Alternate_Manufacturer_Part_Number: N/A; Order_Code_Digikey: SAM1053-06-ND; Order_Code_Farnell: 2037181
CN10 = MCD-00032: Header, 2x1, 2,54mm, VR, TH, Height 5.84mm/2.54mm; Manufacturer_Part_Number: TSW-102-07-G-S; Manufacturer: SAMTEC; Part_Type: Connector; Alternate_Manufacturer_Part_Number: 313102S111116; Alternate_Manufacturer: JIUBABA; Part_Preference: Recommended; Value: Header 2x1; Internal_Part_Number: MCD-00032; Status: Released; ComponentLink1URL: http://tunmcdsvn.tun.st.com/Component_Datasheet_Library/Trunk/Connectors/Samtec_TSW-HTSW-series
CN11 = MCD-00028: USB-MICRO-B, 0.65mm, RA, SMT, Bottom Mount,; Manufacturer_Part_Number: 1050170001; Manufacturer: MOLEX; Part_Type: Connector; Part_Preference: Recommended; Internal_Part_Number: MCD-00028; Status: Released; ComponentLink1URL: http://tunmcdsvn.tun.st.com/Component_Datasheet_Library/Trunk/Connectors/Molex_Connector-USB-microB_105017-0001
D1 = MCD-00034: as D5 on sheet Power_management; Internal_Part_Number: MCD-00034; Value: BAT60JFILM; Manufacturer_Part_Number: BAT60JFILM; Status: Released; ComponentLink1URL: http://tunmcdsvn.tun.st.com/Component_Datasheet_Library/Trunk/Diodes/STM_Diode_BAT60JFILM-SOD323
HW8 = MCD-00122: Shunt, 2.54mm, Black, 4.3A, 6.1mm, 5mR; Part_Type: Misc; Part_Preference: Recommended; Manufacturer: SAMTEC; Full_Alternate_Internal_Part_Number: MCD-00043; Partial_Alternate_Internal_Part_Number: MCD-01849; Order_Code_RS: 158-7784; Component_Country_Of_Origin: China, Costa Rica, Malaysia, USA, Vietnam; ShowFields: YES; ID: 2749; Internal_Part_Number: MCD-00122; Status: Released; Manufacturer_Part_Number: SNT-100-BK-G; Package: 2.54x5.08mm; ComponentLink1URL: http://tunmcdsvn.tun.st.com/Component_Documentation_Library/Trunk/Misc/SAMTEC_SNT-100-BK-G; Order_Code_Digikey: SAM8858-ND; Order_Code_Farnell: 2505007
JP3 = MCD-01904: as JP1 on sheet Power_management; Internal_Part_Number: MCD-01904; Value: Header 2x1; Status: Checked; ComponentLink1URL: http://tunmcdsvn.tun.st.com/Component_Datasheet_Library/Trunk/Connectors/Samtec_TSW-HTSW-series; Alternate_Manufacturer: N/A; Alternate_Manufacturer_Part_Number: N/A; Order_Code_Digikey: SAM1029-02-ND; Order_Code_Farnell: 2505044
LD3 = MCD-02631: LED Bicolor, Red/Green, 2V, 20mA, 4-PLCC; Part_Type: Display; Part_Preference: Recommended; Manufacturer: WURTH ELEKTRONIK; Manufacturer_Part_Number: 150141SV73110; Order_Code_RS: 184-6963; Component_Country_Of_Origin: China; ShowFields: YES; ID: 4737; Internal_Part_Number: MCD-02631; Status: Released; Package: 4-PLCC; ComponentLink1URL: http://tunmcdsvn.tun.st.com/Component_Documentation_Library/Trunk/Display/WURTH_ELEKTRONIK_150141SV73110; Order_Code_Digikey: 732-13404-2-ND; Order_Code_Farnell: 2990869
R9 = MCD-00358: Resistor,10R,0402,1%,1/16W; Manufacturer_Part_Number: RC0402FR-0710RL; Manufacturer: YAGEO; Part_Preference: Recommended; Order_Code_RS: 618-5848; Internal_Part_Number: MCD-00358; Status: Released; Part_Type: Resistor; Package: R0402; ComponentLink1URL: http://tunmcdsvn.tun.st.com/Component_Datasheet_Library/Trunk/Resistors/Yageo_Resistor_RC0402-series; Order_Code_Digikey: 311-10.0LRCT-ND; Order_Code_Farnell: 9238999
R17 R26 R27 = MCD-00065: Resistor,4K7,0402,1%,1/16W; Manufacturer_Part_Number: RC0402FR-074K7L; Manufacturer: YAGEO; Alternate_Manufacturer_Part_Number: RT0402FRE074K7L; Part_Preference: Recommended; Internal_Part_Number: MCD-00065; Alternate_Manufacturer: YAGEO; Status: Released; Part_Type: Resistor; ComponentLink1URL: http://tunmcdsvn.tun.st.com/Component_Datasheet_Library/Trunk/Resistors/Yageo_Resistor_RC0402-series; Package: R0402; Order_Code_Digikey: 311-4.7KLRCT-ND; Order_Code_Farnell: 9239316; Order_Code_RS: N/A
R18 = MCD-00055: Resistor,2K7,0402,1%,1/16W; Manufacturer_Part_Number: RC0402FR-072K7L; Manufacturer: YAGEO; Part_Preference: Recommended; Internal_Part_Number: MCD-00055; Status: Released; Part_Type: Resistor; ComponentLink1URL: http://tunmcdsvn.tun.st.com/Component_Datasheet_Library/Trunk/Resistors/Yageo_Resistor_RC0402-series; Package: R0402; Order_Code_Digikey: 311-2.70KLRCT-ND; Order_Code_Farnell: 9239286; Order_Code_RS: N/A
R19 R23 R36 = MCD-00059: Resistor,100K,0402,1%,1/16W; Manufacturer_Part_Number: RC0402FR-07100KL; Manufacturer: YAGEO; Alternate_Manufacturer_Part_Number: RT0402FRE07100KL; Part_Preference: Recommended; Internal_Part_Number: MCD-00059; Alternate_Manufacturer: YAGEO; Status: Released; Part_Type: Resistor; ComponentLink1URL: http://tunmcdsvn.tun.st.com/Component_Datasheet_Library/Trunk/Resistors/Yageo_Resistor_RC0402-series; Package: R0402; Order_Code_Digikey: 311-100KLRTR-ND; Order_Code_Farnell: 2421891; Order_Code_RS: N/A
R20 R28-R30 = MCD-00052: Resistor,0R,0402,5%,1/16W; Manufacturer_Part_Number: RC0402JR-070RL; Manufacturer: YAGEO; Part_Preference: Recommended; Order_Code_RS: 618-5804; Internal_Part_Number: MCD-00052; Status: Released; Part_Type: Resistor; ComponentLink1URL: http://tunmcdsvn.tun.st.com/Component_Datasheet_Library/Trunk/Resistors/Yageo_Resistor_RC0402-series; Package: R0402; Order_Code_Digikey: 311-0.0JRCT-ND; Order_Code_Farnell: 9232516RL
R21 R22 R50 = MCD-00053: Resistor,10K,0402,1%,1/16W; Manufacturer_Part_Number: RC0402FR-0710KL; Manufacturer: YAGEO; BMS_Part_Number: 9131590; Part_Preference: Recommended; Internal_Part_Number: MCD-00053; Status: Released; Part_Type: Resistor; ComponentLink1URL: http://tunmcdsvn.tun.st.com/Component_Datasheet_Library/Trunk/Resistors/Yageo_Resistor_RC0402-series; Package: R0402; Order_Code_Digikey: 311-10.0KLRCT-ND; Order_Code_Farnell: 9239359; Order_Code_RS: N/A
R25 R31 = MCD-00067: Resistor,100R,0402,1%,1/16W; Manufacturer_Part_Number: RC0402FR-07100RL; Manufacturer: YAGEO; Part_Preference: Recommended; Internal_Part_Number: MCD-00067; Status: Released; Part_Type: Resistor; ComponentLink1URL: http://tunmcdsvn.tun.st.com/Component_Datasheet_Library/Trunk/Resistors/Yageo_Resistor_RC0402-series; Package: R0402; Order_Code_Digikey: 311-100LRCT-ND; Order_Code_Farnell: 9239111; Order_Code_RS: N/A
R32 = MCD-00069: Resistor,36K,0402,1%,1/16W; Manufacturer_Part_Number: RC0402FR-0736KL; Manufacturer: YAGEO; Part_Preference: Recommended; Internal_Part_Number: MCD-00069; Status: Released; Part_Type: Resistor; ComponentLink1URL: http://tunmcdsvn.tun.st.com/Component_Datasheet_Library/Trunk/Resistors/Yageo_Resistor_RC0402-series; Package: R0402; Order_Code_Digikey: 311-36.0KLRCT-ND; Order_Code_Farnell: 1458788; Order_Code_RS: N/A
R33 = MCD-00068: Resistor,1K5,0402,1%,1/16W; Manufacturer_Part_Number: RC0402FR-071K5L; Manufacturer: YAGEO; Part_Preference: Recommended; Internal_Part_Number: MCD-00068; Status: Released; Part_Type: Resistor; ComponentLink1URL: http://tunmcdsvn.tun.st.com/Component_Datasheet_Library/Trunk/Resistors/Yageo_Resistor_RC0402-series; Package: R0402; Order_Code_Digikey: 311-1.50KLRCT-ND; Order_Code_Farnell: 9239251; Order_Code_RS: N/A
R34 R35 = MCD-00062: Resistor,330R,0402,1%,1/16W; Manufacturer_Part_Number: RC0402FR-07330RL; Manufacturer: YAGEO; Part_Preference: Recommended; Internal_Part_Number: MCD-00062; Status: Released; Part_Type: Resistor; ComponentLink1URL: http://tunmcdsvn.tun.st.com/Component_Datasheet_Library/Trunk/Resistors/Yageo_Resistor_RC0402-series; Package: R0402; Order_Code_Digikey: 311-330LRCT-ND; Order_Code_Farnell: 9239170; Order_Code_RS: N/A
R55-R58 = MCD-00189: Resistor,22R,0402,1%,1/16W; Manufacturer_Part_Number: RC0402FR-0722RL; Manufacturer: YAGEO; Part_Preference: Recommended; Internal_Part_Number: MCD-00189; Status: Released; Part_Type: Resistor; Package: R0402; ComponentLink1URL: http://tunmcdsvn.tun.st.com/Component_Datasheet_Library/Trunk/Resistors/Yageo_Resistor_RC0402-series; Order_Code_Digikey: 311-22.0LRCT-ND; Order_Code_Farnell: 9239030; Order_Code_RS: N/A
SB12 = MCD-00072: as SB1 on sheet Power_management; Internal_Part_Number: MCD-00072; Status: Released; Package: SB0603; ComponentLink1URL: http://tunmcdsvn.tun.st.com/Component_Datasheet_Library/Trunk/Resistors/Yageo_Resistor_RC0603-series
T1 = MCD-00073: NPN Bipolar Transistor; Manufacturer_Part_Number: BSR14; Manufacturer: ON SEMICONDUCTOR; Part_Type: IC; Alternate_Manufacturer_Part_Number: MMBT2222LT1G / MMBT2222ALT1G / MMBT2222ALT3G; Part_Preference: Recommended; Revision: *; Internal_Part_Number: MCD-00073; Status: Released; ComponentLink1URL: http://tunmcdsvn.tun.st.com/Component_Datasheet_Library/Trunk/IC/NXP_Transistor_BSR14; Alternate_Manufacturer: ON SEMICONDUCTOR; Package: SOT23
U15 = MCD-00085: Medium-density performance line ARM-based 32-bit MCU with 128KB Flash; Manufacturer: STMICROELECTRONICS; Part_Type: IC; BMS_Part_Number: 9175111; Part_Preference: Recommended; Manufacturer_HQ_COO: EU; Value: STM32F103CBT6; Internal_Part_Number: MCD-00085; Manufacturer_Part_Number: STM32F103CBT6; Status: Released; ComponentLink1URL: http://tunmcdsvn.tun.st.com/Component_Datasheet_Library/Trunk/IC/STM_STM32F103CBT6
U16 = MCD-00251: High power transient voltage suppressor, 7V breakdown; Part_Type: Diode; Manufacturer: STMICROELECTRONICS; BMS_Part_Number: 9179042; Part_Preference: Recommended; Manufacturer_HQ_COO: EU; Internal_Part_Number: MCD-00251; Status: Released; Manufacturer_Part_Number: ESDA7P60-1U1M; ComponentLink1URL: http://tunmcdsvn.tun.st.com/Component_Datasheet_Library/Trunk/Diodes/STM_ESD_ESDA7P60-1U1M
U17 = MCD-00649: Common mode filter with ESD protection for USB 2.0 interface; Part_Type: Diode; Manufacturer: STMICROELECTRONICS; BMS_Part_Number: 9151138; Part_Preference: Recommended; Manufacturer_HQ_COO: EU; Internal_Part_Number: MCD-00649; Value: ECMF02-2AMX6; Status: Released; Manufacturer_Part_Number: ECMF02-2AMX6; ComponentLink1URL: http://tunmcdsvn.tun.st.com/Component_Datasheet_Library/Trunk/Diodes/STM_ESD_ECMF02-2AMX6
X1 = MCD-00092: Crystal 8MHz, 8pF, +-20ppm, 500ohms max,  SMD; Manufacturer_Part_Number: NX3225GD 8MHz EXS00A-CG04874; Manufacturer: NDK; Part_Type: Crystal oscillator; BMS_Part_Number: 9157029; Part_Preference: Recommended; Internal_Part_Number: MCD-00092; Status: Released; ComponentLink1URL: http://tunmcdsvn.tun.st.com/Component_Datasheet_Library/Trunk/Crystal_Osc/NDK_Crystal-For-ST_NX3225GD 8MHz EXS00A-CG04874 (EXS10B-20725); Order_Code_Digikey: 644-1391

## Nets that join several sheets
3V3: MCU_Display (C49.1 U19.8), LEDs_Buttons (8 pins), Connectors (6 pins), Power_management (5 pins)
3V3_STLK: Power_management (C27.2 C28.2 U13.5), ST-LINK_V2-1 (16 pins)
3V6_LDO: MCU_Display (C50.1 U19.5), Power_management (C24.2 U12.5)
5V: LEDs_Buttons (LD4.1), Connectors (CN2.5 CN5.6 CN5.15), Power_management (12 pins), ST-LINK_V2-1 (D1.1)
5V_INT: Connectors (R1.2), Power_management (5 pins)
5V_USB_MCU: Connectors (C2.1 CN6.1 U3.1), Power_management (D5.1 JP2.4)
5V_USB_STLK: Power_management (6 pins), ST-LINK_V2-1 (C41.1 CN11.1 R50.2 U16.1)
AVDD: Connectors (CN1.8), Power_management (5 pins)
GND: MCU_Display (15 pins), LEDs_Buttons (20 pins), Connectors (26 pins), Power_management (35 pins), ST-LINK_V2-1 (35 pins)
VDD_AUX: LEDs_Buttons (D2.1 D3.1), Connectors (CN13.2), Power_management (JP1.1 SB2.2 SB5.2), ST-LINK_V2-1 (R26.1)
VIN: Connectors (CN2.8), Power_management (C13.1 C15.2 SB1.2 U9.3)
ARD.D2_IO: MCU_Display (U1.66), Connectors (CN4.3)
ARD.D3_TIM: MCU_Display (U1.63), Connectors (CN4.4)
ARD.D4_IO: MCU_Display (U1.42), Connectors (CN4.5)
ARD.D5_TIM: MCU_Display (C55.2 U1.47), Connectors (CN4.6)
ARD.D6_TIM: MCU_Display (U1.79), Connectors (CN4.7)
ARD.D7: MCU_Display (U1.48), Connectors (CN4.8)
ARD.D8: MCU_Display (U1.65), Connectors (CN1.1)
ARD.D9_TIM: MCU_Display (U1.76), Connectors (CN1.2)
ARD.D10_SPI1_NSS_TIM: MCU_Display (U1.55), Connectors (CN1.3)
ARD.D11_SPI1_MOSI_TIM: MCU_Display (U1.52 U19.15), LEDs_Buttons (U21.1), Connectors (CN1.4)
ARD.D12_SPI1_MISO: MCU_Display (U1.20), Connectors (CN1.5)
ARD.D13_SPI1_SCK: MCU_Display (U1.2 U19.14), Connectors (CN1.6)
ARD_ADC.ADC1_IN4: MCU_Display (U1.7), Connectors (CN3.1)
ARD_ADC.ADC1_IN7: MCU_Display (U1.1), Connectors (CN3.2)
ARD_ADC.ADC1_IN13: MCU_Display (U1.49), Connectors (CN3.5)
ARD_ADC.ADC1_IN14: MCU_Display (C54.1 U1.45), Connectors (CN3.6)
BOOT0: MCU_Display (U1.13), Connectors (CN13.1 R54.2)
COM.ADC1_IN2: MCU_Display (U1.9), Connectors (CN3.4 CN5.20)
COM.ADC1_IN10: MCU_Display (U1.54), Connectors (CN3.3 CN5.19 CN15.1)
COM.I2C1_SCL: MCU_Display (U1.14), Connectors (CN1.10 CN5.7 R24.1)
COM.I2C1_SDA: MCU_Display (U1.28), Connectors (CN1.9 CN5.10 R44.1)
GPIO_SELECT1: MCU_Display (U1.78), Connectors (R6.1 U2.9)
GPIO_SELECT2: MCU_Display (U1.62), LEDs_Buttons (JP4.1 JP5.2)
LPUART1_RX_MCU: MCU_Display (U1.12), Connectors (U2.7)
LPUART1_TX_MCU: MCU_Display (U1.19), Connectors (U2.8)
NRST: MCU_Display (U1.10), LEDs_Buttons (B3.1 B3.3 C44.1), Connectors (CN2.3), ST-LINK_V2-1 (R55.2 U15.18)
PWR_ENn: Power_management (R15.1 U11.4), ST-LINK_V2-1 (U15.28)
QSPI_BK_IO0: MCU_Display (U1.11), LEDs_Buttons (U20.2)
SAI1_CK2: MCU_Display (U1.50), Connectors (CN12.1)
SAI1_DI2: MCU_Display (U1.51), Connectors (CN14.1)
STMOD+.ADC1_IN5: MCU_Display (U1.3), Connectors (CN5.13)
STMOD+.GPIO1: MCU_Display (U1.23), Connectors (CN5.17)
STMOD+.GPIO2: MCU_Display (U1.22), Connectors (CN5.18)
STMOD+.INT: MCU_Display (U1.72), Connectors (CN5.11)
STMOD+.LPUART1_CTS: MCU_Display (U1.53), Connectors (R2.1)
STMOD+.LPUART1_RTS: MCU_Display (U1.41), Connectors (R5.1)
STMOD+.RST: MCU_Display (U1.75), Connectors (CN5.12)
STMOD+.SPI2_MISO: MCU_Display (U1.8), Connectors (CN5.3 R4.2)
STMOD+.SPI2_MISO2: MCU_Display (U1.37), Connectors (CN5.9)
STMOD+.SPI2_MOSI: MCU_Display (U1.73), Connectors (CN5.2 R3.2)
STMOD+.SPI2_MOSI2: MCU_Display (U1.38), Connectors (CN5.8)
STMOD+.SPI2_NSS: MCU_Display (U1.33), Connectors (CN5.1 R2.2)
STMOD+.SPI2_SCK: MCU_Display (U1.34), Connectors (CN5.4 R5.2)
STMOD+.TIM2_CH1: MCU_Display (U1.27), Connectors (CN5.14)
T_SWCLK: MCU_Display (U1.26), ST-LINK_V2-1 (R56.2 U15.15 U15.26)
T_SWDIO: MCU_Display (U1.25), ST-LINK_V2-1 (R25.1 R58.2 U15.27)
T_SWO: MCU_Display (U1.21), ST-LINK_V2-1 (R57.1 U15.31)
TSC_G4_IO1: MCU_Display (U1.36), LEDs_Buttons (C43.2)
TSC_G4_IO2: MCU_Display (U1.71), LEDs_Buttons (D2.2 R40.1)
TSC_G6_IO1: MCU_Display (U1.77), LEDs_Buttons (C45.1)
TSC_G6_IO2: MCU_Display (U1.82), LEDs_Buttons (D3.2 R41.1)
USB_N: MCU_Display (U1.30), Connectors (U14.2)
USB_P: MCU_Display (U1.29), Connectors (U14.1)
User-B1: MCU_Display (U1.24), LEDs_Buttons (B1.1 B1.2)
User-B2: MCU_Display (U1.40), LEDs_Buttons (B2.1 B2.2)
VCP_RX: MCU_Display (U1.18), ST-LINK_V2-1 (R28.2)
VCP_TX: MCU_Display (U1.39), ST-LINK_V2-1 (R29.1)

## Assembly variants
WB5MM: not fitted CN7 CN8 CN9 CN10 CN12 CN13 CN14 CN15 CN16 R20 R22 R30 SB1 SB3 SB4 SB5 SB10 SB12